# Altium schematic sheet BSPD.SchDoc: Brake System Plausibility Device
size A4
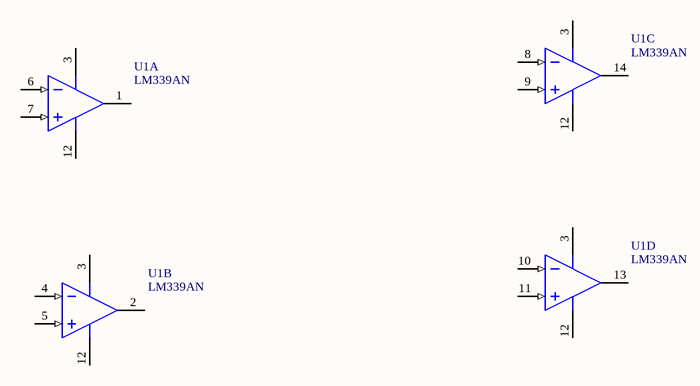
[diagram p0: BSPD.SchDoc]

## Parts
U1  LM339AN  [TI-N0014A]  (parts A,B,C,D of 4)

## Nets

Not connected (* = marked no-connect by the designer): U1 1(OUT1) 2(OUT2) 3(VCC) 4(IN2-) 5(IN2+) 6(IN1-) 7(IN1+) 8(IN3-) 9(IN3+) 10(IN4-) 11(IN4+) 12(GND) 13(OUT4) 14(OUT3)

## Library data of the parts
U1 = CMP-018-00002-1: Quad Differential Comparator, 2 to 30 V, 0 to 70 degC, 14-Pin DIP (N), Pb-Free (RoHS), Tube; Manufacturer: Texas Instruments; Max Dual Supply Voltage: 15V; Nominal Supply Current: 500uA; Power: 1.05W; Elements: 4; Max Supply Voltage: 30V; Nominal Voltage Gain: 106.02dB; Min Dual Supply Voltage: 1V; Min Supply Voltage: 2V; RoHS Compliant: True; Packaging: Rail/Tube; Package Quantity: 25; Package Reference: N-14; Package URL: http://www.ti.com/lit/ml/mpdi002c/mpdi002c.pdf; Max Operating Temperature: 70°C; Package Description: 14-Pin Double In-line Package, Body 19.305 x 6.35 mm, Pitch 2.54 mm; Pins: 14; Manufacturer URL: http://www.ti.com/; Case/Package: PDIP; Datasheet Version: SLCS006S, 08/2012; Mounting Technology: TH; Datasheet URL: http://www.ti.com/general/docs/lit/getliterature.tsp?genericPartNumber=LM339A&fileType=pdf; Min Operating Temperature: 0°C